# EAGLE design bldc (EAGLE 6.4)
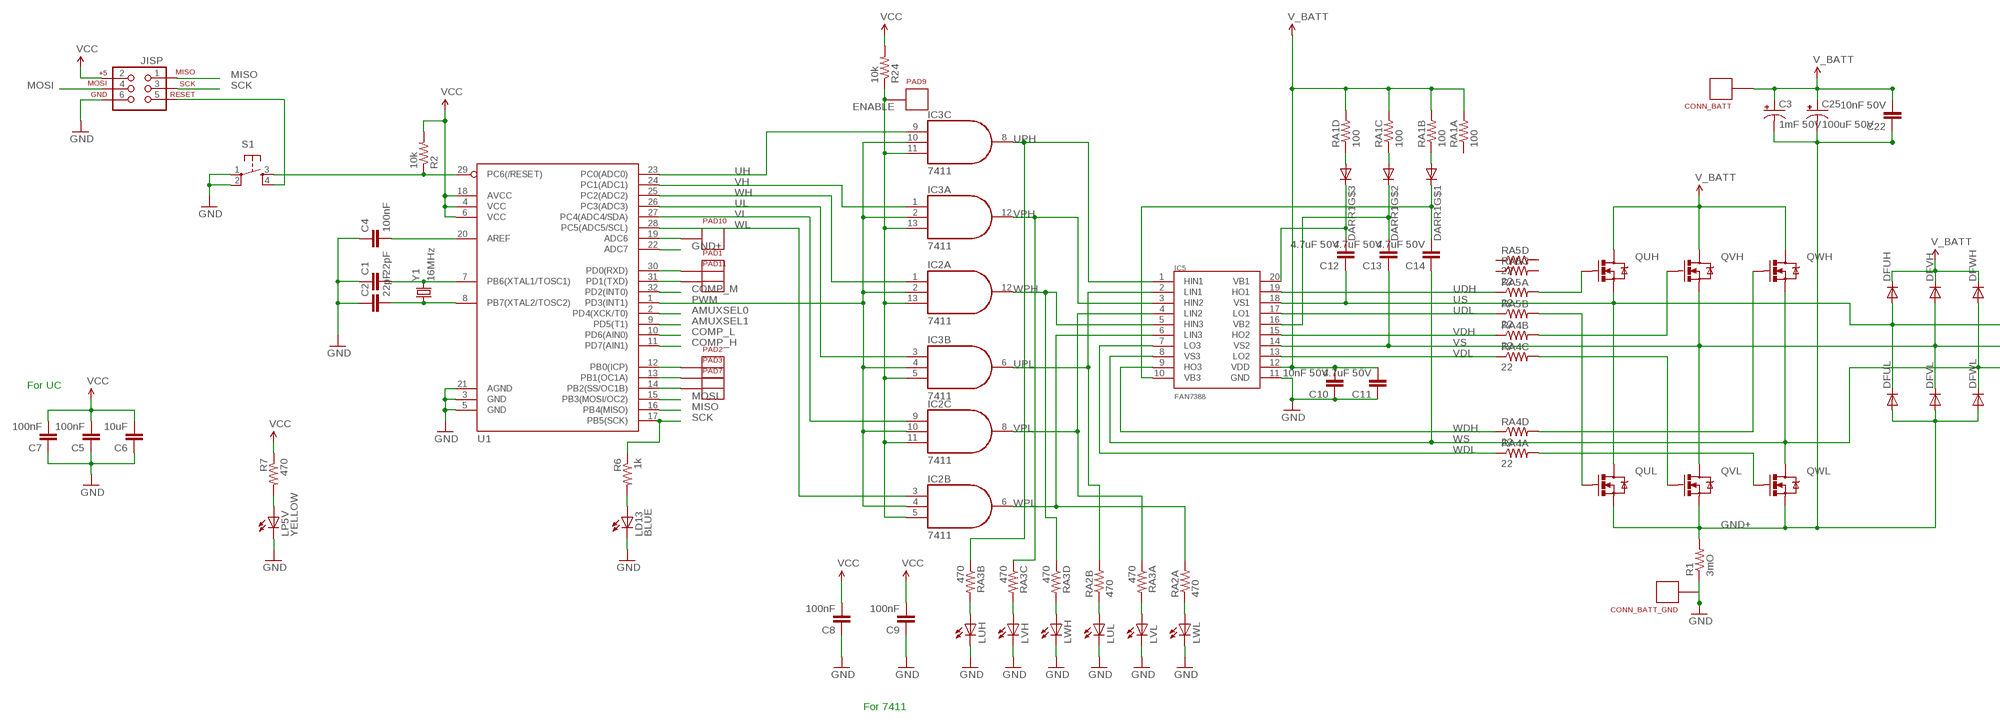
[diagram p0: schematic, sheet 1, part 1 of 2]
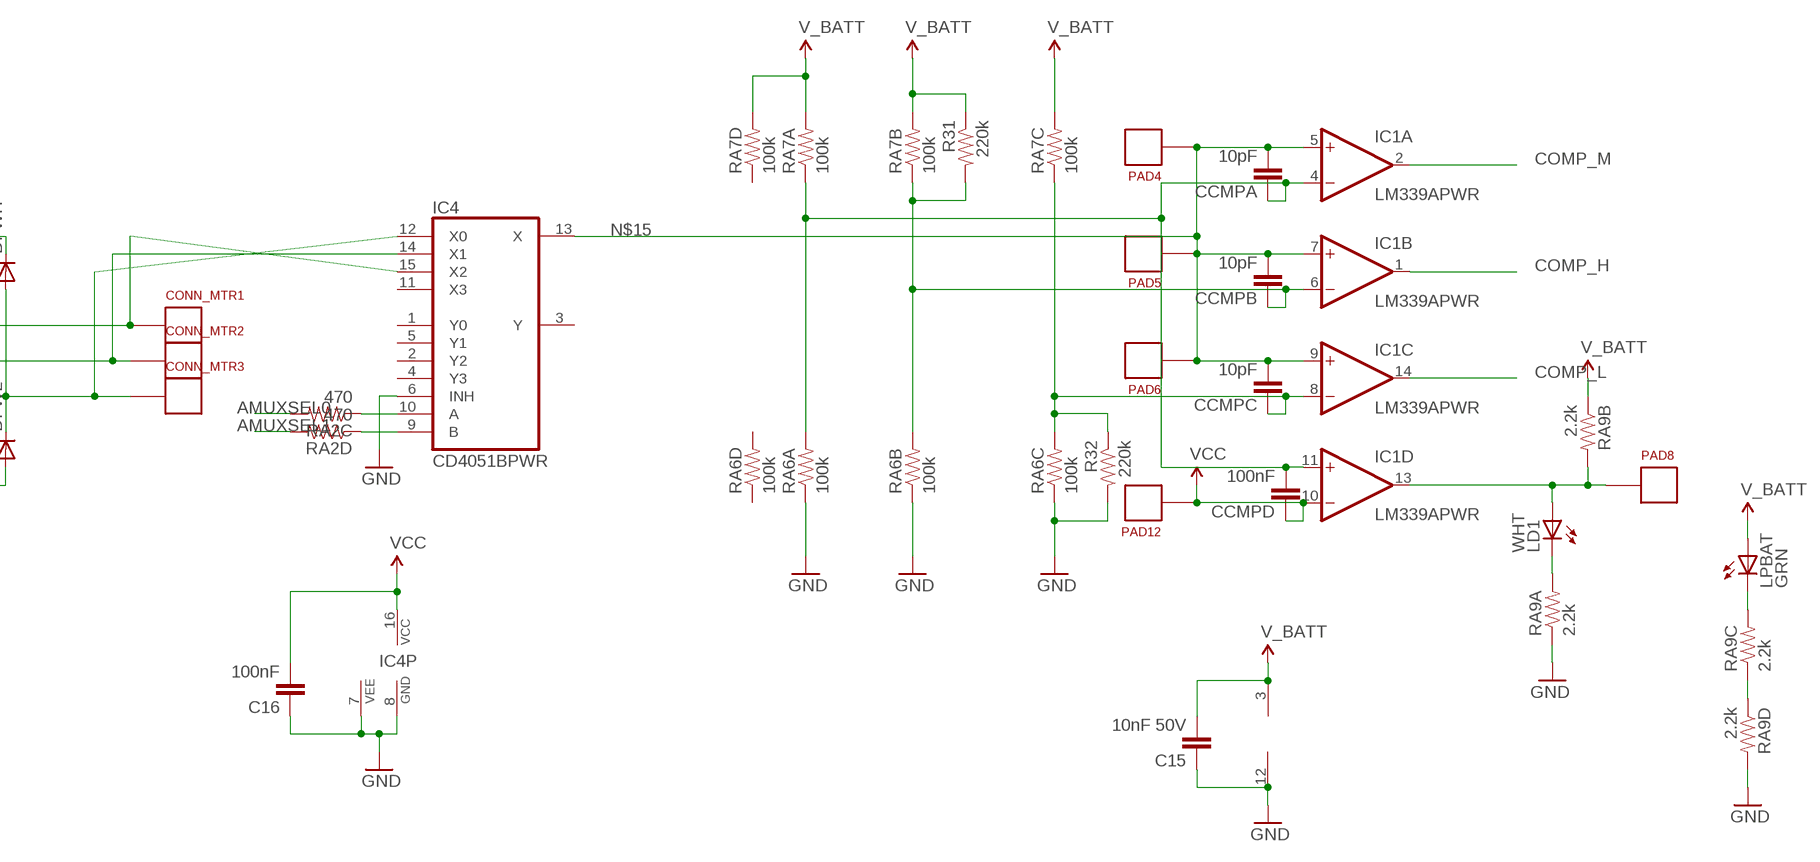
[diagram p1: schematic, sheet 1, part 2 of 2]

## Parts
C1  22pF  10NF-CER  [0402-CAP]
C2  22pF  10NF-CER  [0402-CAP]
C3  1mF 50V  CAP_POLPTH5  [CPOL-RADIAL-1000UF-50V]
C4  100nF  10NF-CER  [0402-CAP]
C5  100nF  10NF-CER  [0402-CAP]
C6  10uF  22UF-6.3V-20%(0805)  [0805]
C7  100nF  10NF-CER  [0402-CAP]
C8  100nF  10NF-CER  [0402-CAP]
C9  100nF  10NF-CER  [0402-CAP]
C10  10nF 50V  10NF-CER  [0402-CAP]
C11  4.7uF 50V  22UF-6.3V-20%(0805)  [0805]
C12  4.7uF 50V  22UF-6.3V-20%(0805)  [0805]
C13  4.7uF 50V  22UF-6.3V-20%(0805)  [0805]
C14  4.7uF 50V  22UF-6.3V-20%(0805)  [0805]
C15  10nF 50V  10NF-CER  [0402-CAP]
C16  100nF  10NF-CER  [0402-CAP]
C22  10nF 50V  10NF-CER  [0402-CAP]
C25  100uF 50V  CAP_POLPTH1  [CPOL-RADIAL-100UF-25V]
CCMPA  10pF  10NF-CER  [0402-CAP]
CCMPB  10pF  10NF-CER  [0402-CAP]
CCMPC  10pF  10NF-CER  [0402-CAP]
CCMPD  100nF  10NF-CER  [0402-CAP]
CONN_BATT  CONNECTOR18AWG  [HOLE_18AWG]
CONN_BATT_GND  CONNECTOR18AWG  [HOLE_18AWG]
CONN_MTR1  CONNECTOR18AWG  [HOLE_18AWG]
CONN_MTR2  CONNECTOR18AWG  [HOLE_18AWG]
CONN_MTR3  CONNECTOR18AWG  [HOLE_18AWG]
DARR1  SD103ATW-7-F  [SOT363]
DFUH  DIODESOD123W  [SOD123W(NXP)]
DFUL  DIODESOD123W  [SOD123W(NXP)]
DFVH  DIODESOD123W  [SOD123W(NXP)]
DFVL  DIODESOD123W  [SOD123W(NXP)]
DFWH  DIODESOD123W  [SOD123W(NXP)]
DFWL  DIODESOD123W  [SOD123W(NXP)]
IC1  LM339APWR  LM339  [TSSOP14]
IC2  7411  [TSSOP14]
IC3  7411  [TSSOP14]
IC4  CD4051BPWR  4052  [TSSOP16]
IC5  FAN7388  [SO20W]
JISP  AVR_SPI_PRG_6PTH  [2X3]
LD1  WHT  LED0603  [0603_LED]
LD13  BLUE  LED0603  [0603_LED]
LP5V  YELLOW  LED0603  [0603_LED]
LPBAT  GRN  LED0603  [0603_LED]
LUH  LED0603  [0603_LED]
LUL  LED0603  [0603_LED]
LVH  LED0603  [0603_LED]
LVL  LED0603  [0603_LED]
LWH  LED0603  [0603_LED]
LWL  LED0603  [0603_LED]
PAD1  PD0  CONNECTOR  [TESTPAD]
PAD2  PB0  CONNECTOR  [TESTPAD]
PAD3  PB1  CONNECTOR  [TESTPAD]
PAD4  CMPA  CONNECTOR  [TESTPAD]
PAD5  CMPB  CONNECTOR  [TESTPAD]
PAD6  CMPC  CONNECTOR  [TESTPAD]
PAD7  PB2  CONNECTOR  [TESTPAD]
PAD8  PGD  CONNECTOR  [TESTPAD]
PAD9  ENBL  CONNECTOR  [TESTPAD]
PAD10  ADC6  CONNECTOR  [TESTPAD]
PAD11  PD1  CONNECTOR  [TESTPAD]
PAD12  VREF  CONNECTOR  [TESTPAD]
QUH  NXP_LFPAK_NFET  [POWERSO8]
QUL  NXP_LFPAK_NFET  [POWERSO8]
QVH  NXP_LFPAK_NFET  [POWERSO8]
QVL  NXP_LFPAK_NFET  [POWERSO8]
QWH  NXP_LFPAK_NFET  [POWERSO8]
QWL  NXP_LFPAK_NFET  [POWERSO8]
R1  3mO  RESISTOROAR5  [OAR5]
R2  10k  RESISTOR0603-RES  [0603-RES]
R6  1k  RESISTOR0603-RES  [0603-RES]
R7  470  RESISTOR0603-RES  [0603-RES]
R24  10k  RESISTOR0603-RES  [0603-RES]
R31  220k  RESISTOR0603-RES  [0603-RES]
R32  220k  RESISTOR0603-RES  [0603-RES]
RA1  100  RESISTOR_ARRAY0603_X4  [0603-ARV]
RA2  470  RESISTOR_ARRAY0603_X4  [0603-ARV]
RA3  470  RESISTOR_ARRAY0603_X4  [0603-ARV]
RA4  22  RESISTOR_ARRAY0603_X4  [0603-ARV]
RA5  22  RESISTOR_ARRAY0603_X4  [0603-ARV]
RA6  100k  RESISTOR_ARRAY0603_X4  [0603-ARV]
RA7  100k  RESISTOR_ARRAY0603_X4  [0603-ARV]
RA9  2.2k  RESISTOR_ARRAY0603_X4  [0603-ARV]
S1  TAC_SWITCHPTH  [TACTILE-PTH]
U1  ATMEGA328_SMT  [TQFP32-08]
Y1  16MHz  CRYSTALSMD  [HC49UP]

## Nets
AMUXSEL0: RA2.6 U1.2(PD4(XCK/T0))
AMUXSEL1: RA2.5 U1.9(PD5(T1))
COMP_H: IC1.1(B:OUT) U1.11(PD7(AIN1))
COMP_L: IC1.14(C:OUT) U1.10(PD6(AIN0))
COMP_M: IC1.2(A:OUT) U1.32(PD2(INT0))
CTL0: PAD2.P U1.12(PB0(ICP))
CTL1: PAD3.P U1.13(PB1(OC1A))
CTL2: PAD7.P U1.14(PB2(SS/OC1B))
CTL3: PAD1.P U1.30(PD0(RXD))
ENABLE: IC2.5(B:I2) IC2.11(C:I2) IC2.13(A:I2) IC3.5(B:I2) IC3.11(C:I2) IC3.13(A:I2) PAD9.P R24.1
GND: C1.1 C2.1 C4.1 C5.1 C6.1 C7.1 C8.1 C9.1 C10.1 C11.1 C15.1 C16.1 CONN_BATT_GND.P$1(P) IC1.12(P:GND) IC4.6(INH) IC4.7(VEE) IC4.8(GND) IC5.11(GND) JISP.6 LD13.C LP5V.C LUH.C LUL.C LVH.C LVL.C LWH.C LWL.C R1.P$1 R32.2 RA6.1 RA6.2 RA6.3 RA9.1 RA9.5 S1.1 S1.2 U1.3(GND) U1.5(GND) U1.21(AGND)
GND+: C3.2(-) C22.1 C25.2(-) DFUL.A DFVL.A DFWL.A QUL.P1(S) QUL.P2(S) QUL.P3(S) QVL.P1(S) QVL.P2(S) QVL.P3(S) QWL.P1(S) QWL.P2(S) QWL.P3(S) R1.P$2 U1.22(ADC7)
GUH: QUH.P4(G) RA5.8
GUL: QUL.P4(G) RA5.7
GVH: QVH.P4(G) RA4.7
GVL: QVL.P4(G) RA4.6
GWH: QWH.P4(G) RA4.5
GWL: QWL.P4(G) RA4.8
MISO: JISP.1 U1.16(PB4(MISO))
MOSI: JISP.4 U1.15(PB3(MOSI/OC2))
N$1: C1.2 U1.7(PB6(XTAL1/TOSC1)) Y1.2
N$2: C2.2 U1.8(PB7(XTAL2/TOSC2)) Y1.1
N$3: CCMPA.1 CCMPD.2 IC1.4(A:-IN) IC1.11(D:+IN) RA6.8 RA7.1
N$4: IC1.13(D:OUT) LD1.A PAD8.P RA9.7
N$5: C4.2 U1.20(AREF)
N$6: LD13.A R6.2
N$7: RA9.3 RA9.4
N$8: LUH.A RA3.7
N$9: LWL.A RA2.1
N$10: LP5V.A R7.2
N$11: CCMPB.1 IC1.6(B:-IN) R31.2 RA6.7 RA7.2
N$12: IC4.10(A) RA2.3
N$13: LD1.C RA9.8
N$14: IC4.9(B) RA2.4
N$15: CCMPA.2 CCMPB.2 CCMPC.2 IC1.5(A:+IN) IC1.7(B:+IN) IC1.9(C:+IN) IC4.13(X) PAD4.P PAD5.P PAD6.P
N$16: LPBAT.C RA9.6
N$17: CCMPC.1 IC1.8(C:-IN) R32.1 RA6.6 RA7.3
N$20: C14.2 DARR1.1(C) IC5.10(VB3)
N$21: DARR1.4(A) RA1.4
N$22: DARR1.5(A) RA1.3
N$23: DARR1.6(A) RA1.2
N$24: JISP.5 S1.4
N$25: LVH.A RA3.6
N$26: LWH.A RA3.5
N$27: LUL.A RA2.2
N$28: PAD10.P U1.19(ADC6)
N$29: PAD11.P U1.31(PD1(TXD))
N$30: C13.2 DARR1.2(C) IC5.16(VB2)
N$31: C12.2 DARR1.3(C) IC5.20(VB1)
N$36: LVL.A RA3.8
PWM: IC2.2(A:I1) IC2.4(B:I1) IC2.10(C:I1) IC3.2(A:I1) IC3.4(B:I1) IC3.10(C:I1) U1.1(PD3(INT1))
RESET: R2.1 S1.3 U1.29(PC6(/RESET))
SCK: JISP.3 R6.1 U1.17(PB5(SCK))
UDH: IC5.19(HO1) RA5.1
UDL: IC5.17(LO1) RA5.2
UH: IC3.9(C:I0) U1.23(PC0(ADC0))
UL: IC3.3(B:I0) U1.26(PC3(ADC3))
UPH: IC3.8(C:O) IC5.1(HIN1) RA3.2
UPL: IC3.6(B:O) IC5.2(LIN1) RA2.7
US: C12.1 CONN_MTR1.P$1(P) DFUH.A DFUL.C IC4.15(X2) IC5.18(VS1) QUH.P1(S) QUH.P2(S) QUH.P3(S) QUL.P$1(D) QUL.P$5(D) QUL.P$6(D) QUL.P$7(D) QUL.P$8(D) QUL.P$9(D) QUL.P$10(D) QUL.P$11(D) QUL.P$12(D) QUL.P$13(D) QUL.P$14(D) QUL.P$15(D) QUL.P$16(D) QUL.P$17(D) QUL.P$19(D) QUL.P$20(D) QUL.P$21(D)
V_BATT: C3.1(+) C10.2 C11.2 C15.2 C22.2 C25.1(+) CONN_BATT.P$1(P) DFUH.C DFVH.C DFWH.C IC1.3(P:V+) IC5.12(VDD) LPBAT.A QUH.P$1(D) QUH.P$5(D) QUH.P$6(D) QUH.P$7(D) QUH.P$8(D) QUH.P$9(D) QUH.P$10(D) QUH.P$11(D) QUH.P$12(D) QUH.P$13(D) QUH.P$14(D) QUH.P$15(D) QUH.P$16(D) QUH.P$17(D) QUH.P$19(D) QUH.P$20(D) QUH.P$21(D) QVH.P$1(D) QVH.P$5(D) QVH.P$6(D) QVH.P$7(D) QVH.P$8(D) QVH.P$9(D) QVH.P$10(D) QVH.P$11(D) QVH.P$12(D) QVH.P$13(D) QVH.P$14(D) QVH.P$15(D) QVH.P$16(D) QVH.P$17(D) QVH.P$19(D) QVH.P$20(D) QVH.P$21(D) QWH.P$1(D) QWH.P$5(D) QWH.P$6(D) QWH.P$7(D) QWH.P$8(D) QWH.P$9(D) QWH.P$10(D) QWH.P$11(D) QWH.P$12(D) QWH.P$13(D) QWH.P$14(D) QWH.P$15(D) QWH.P$16(D) QWH.P$17(D) QWH.P$19(D) QWH.P$20(D) QWH.P$21(D) R31.1 RA1.5 RA1.6 RA1.7 RA1.8 RA7.5 RA7.6 RA7.7 RA7.8 RA9.2
VCC: C5.2 C6.2 C7.2 C8.2 C9.2 C16.2 CCMPD.1 IC1.10(D:-IN) IC4.16(VCC) JISP.2 PAD12.P R2.2 R7.1 R24.2 U1.4(VCC) U1.6(VCC) U1.18(AVCC)
VDH: IC5.15(HO2) RA4.2
VDL: IC5.13(LO2) RA4.3
VH: IC3.1(A:I0) U1.24(PC1(ADC1))
VL: IC2.9(C:I0) U1.27(PC4(ADC4/SDA))
VPH: IC3.12(A:O) IC5.3(HIN2) RA3.3
VPL: IC2.8(C:O) IC5.4(LIN2) RA3.1
VS: C13.1 CONN_MTR2.P$1(P) DFVH.A DFVL.C IC4.14(X1) IC5.14(VS2) QVH.P1(S) QVH.P2(S) QVH.P3(S) QVL.P$1(D) QVL.P$5(D) QVL.P$6(D) QVL.P$7(D) QVL.P$8(D) QVL.P$9(D) QVL.P$10(D) QVL.P$11(D) QVL.P$12(D) QVL.P$13(D) QVL.P$14(D) QVL.P$15(D) QVL.P$16(D) QVL.P$17(D) QVL.P$19(D) QVL.P$20(D) QVL.P$21(D)
WDH: IC5.9(HO3) RA4.4
WDL: IC5.7(LO3) RA4.1
WH: IC2.1(A:I0) U1.25(PC2(ADC2))
WL: IC2.3(B:I0) U1.28(PC5(ADC5/SCL))
WPH: IC2.12(A:O) IC5.5(HIN3) RA3.4
WPL: IC2.6(B:O) IC5.6(LIN3) RA2.8
WS: C14.1 CONN_MTR3.P$1(P) DFWH.A DFWL.C IC4.12(X0) IC5.8(VS3) QWH.P1(S) QWH.P2(S) QWH.P3(S) QWL.P$1(D) QWL.P$5(D) QWL.P$6(D) QWL.P$7(D) QWL.P$8(D) QWL.P$9(D) QWL.P$10(D) QWL.P$11(D) QWL.P$12(D) QWL.P$13(D) QWL.P$14(D) QWL.P$15(D) QWL.P$16(D) QWL.P$17(D) QWL.P$19(D) QWL.P$20(D) QWL.P$21(D)
Unconnected: IC4.1(Y0) IC4.2(Y2) IC4.3(Y) IC4.4(Y3) IC4.5(Y1) IC4.11(X3) RA1.1 RA5.3 RA5.4 RA5.5 RA5.6 RA6.4 RA6.5 RA7.4

## Notes on the sheet
- For UC
- For 7411

## Power pins joined to a net without a drawn wire
GND: IC2.7(P:GND) IC3.7(P:GND)
VCC: IC2.14(P:VCC) IC3.14(P:VCC)

## Library data of the parts
C1 C2 C4 C5 C7-C10 C15 C16 C22 CCMPA CCMPB CCMPC CCMPD = SparkFun-Capacitors:10NF-CER: 10nF/.01uF/10000pF ceramic SMT CAP-00867- 50V 10% (0603); PROD_ID: CAP-00867; VALUE: 10nF
C3 C25 = kmod:CAP_POL: Capacitor Polarized These are standard SMD and PTH capacitors. Normally 10uF, 47uF, and 100uF in electrolytic and tantalum varieties. Always verify the external diameter of the through hole cap, it varies with capacity, voltage, and manufacturer. The EIA devices should be standard.
C6 C11 = SparkFun-Capacitors:22UF-6.3V-20%(0805): Ceramic CAP-08402; PROD_ID: CAP-08402; VALUE: 22uF
C12-C14 = SparkFun-Capacitors:22UF-6.3V-20%(0805): Ceramic CAP-08402; PROD_ID: CAP-08402; VALUE: 22uF; VOLTAGE: 40
CONN_BATT CONN_BATT_GND CONN_MTR1-CONN_MTR3 PAD1-PAD12 = kmod:CONNECTOR
DARR1 = kmod:SD103ATW-7-F: Diode array: 3x
DFUH DFUL DFVH DFVL DFWH DFWL = kmod:DIODE
IC1 = kmod:LM339: Low Power Low Offset Voltage Quad Comparators with open collector; LM139/LM239/LM339/LM2901/LM3302
IC2 IC3 = kmod:74*11: Triple 3-input AND gate
IC4 = kmod:4052: Dual 4-channel ANALOG MULTIPLEXER
IC5 = kmod:FAN7388
JISP = SparkFun-Connectors:AVR_SPI_PRG_6: AVR ISP 6 Pin This is the reduced ISP connector for AVR programming. Common on Arduino. This footprint will take up less PCB space and can be used with a 10-pin to 6-pin adapter such as SKU: BOB-08508
LD1 LD13 LP5V LPBAT LUH LUL LVH LVL LWH LWL = kmod:LED
QUH QUL QVH QVL QWH QWL = kmod:NXP_LFPAK_NFET
R1 = kmod:RESISTOR: Resistor Basic schematic elements and footprints for 0603, 1206, and PTH resistors.
R2 R6 R7 R24 R31 R32 = SparkFun-Resistors:RESISTOR: Resistor Basic schematic elements and footprints for 0603, 1206, and PTH resistors.
RA1-RA7 RA9 = kmod:RESISTOR_ARRAY
S1 = SparkFun-Electromechanical:TAC_SWITCH: Momentary Switch Button commonly used for reset or general input. Spark Fun Electronics SKU : COM-00097 SMT- SWCH-08247
U1 = SparkFun-DigitalIC:ATMEGA328_SMT: 32-Pin Atmega328 part Commonly used on Arduino compatible boards Available in QFP and QFN packages TQFP is IC-09069 QFN is non-stock; PROD_ID: IC-09069; VALUE: ATMEGA328P
Y1 = SparkFun-FreqCtrl:CRYSTAL: Various standard crystals. Proven footprints. Spark Fun Electronics SKU : COM-00534

## Board
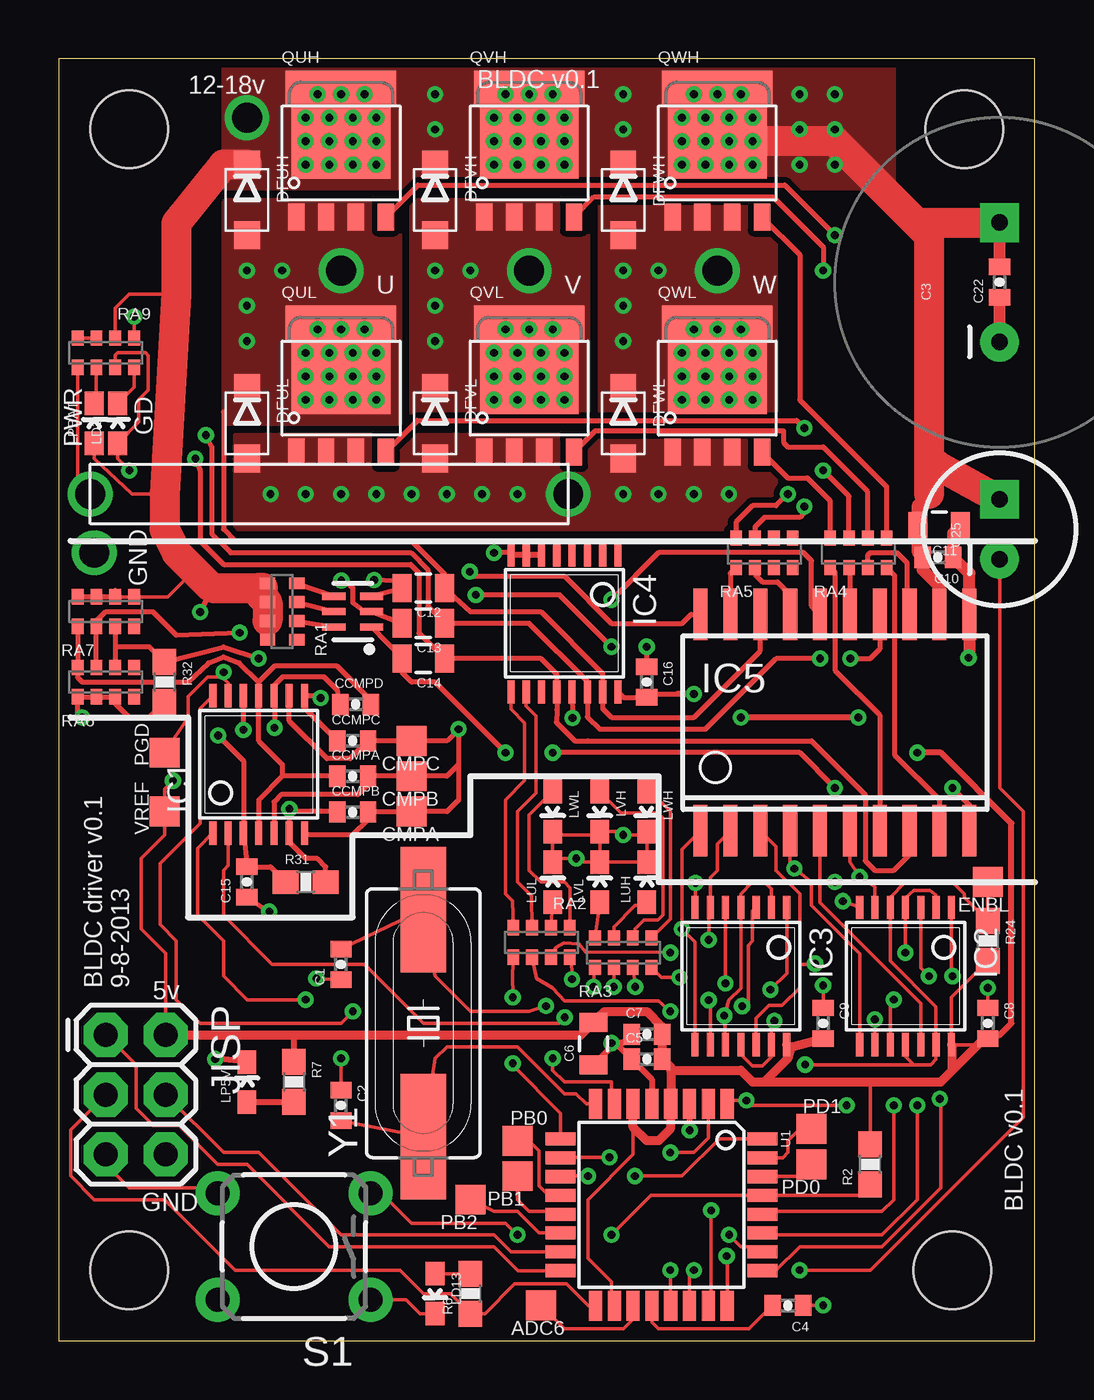
[diagram p2: board, top side]
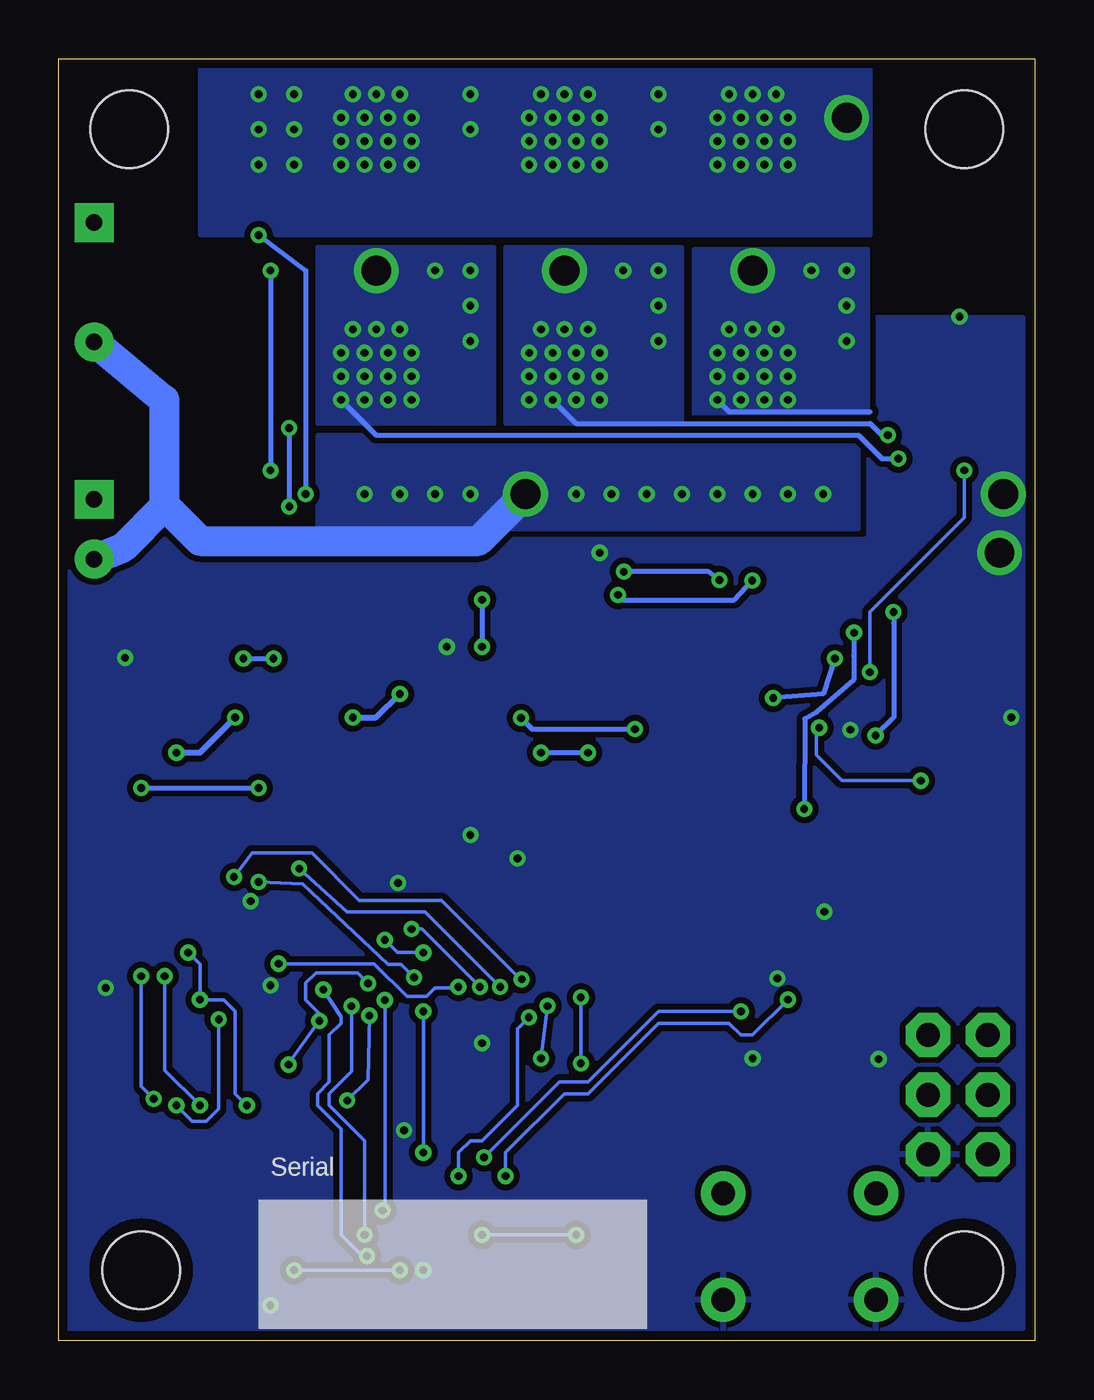
[diagram p3: board, bottom side, seen from below]

Size 41.5 x 54.5 mm. Coordinates in mm from the lower left corner, seen from the top.
Outline: 0,0 41.5,0 41.5,54.5 0,54.5 0,0
Copper layers (1*16): Top 0.0356mm / dielectric 1.5011mm / Bottom 0.0356mm
Design rules "OSHPark_mine": minimum track width 6mil, minimum drill 13mil, track to track 6mil, track to pad 6mil, pad to pad 6mil, via to via 6mil, smd to smd 6mil, copper to edge 15mil, drill to drill 6mil, minimum pad ring 7mil, minimum via ring 7mil, stop-mask expansion 4mil, vias tented up to drill 0mil, thermal gap 10mil

### Footprints (pad centres in the part's own frame; a part is rotated, then mirrored left to right if it is on the bottom)
0402-CAP = smd 0.7 x 0.9: 1 -0.65,0; 2 0.65,0
CPOL-RADIAL-1000UF-50V = drill 0.7 pad 1.651 square: 1 2.54,0 | drill 0.7 pad 1.651: 2 -2.54,0
0805 = smd 0.8 x 1.2: 1 -0.9,0; 2 0.9,0
CPOL-RADIAL-100UF-25V = drill 0.7 pad 1.651 square: 1 1.27,0 | drill 0.7 pad 1.651: 2 -1.27,0
HOLE_18AWG = drill 1.27: P$1 0,0
SOT363 = smd 0.3 x 0.99: 1 -0.65,-0.8; 2 0,-0.8; 3 0.65,-0.8; 4 0.65,0.81; 5 0,0.81; 6 -0.65,0.81
SOD123W(NXP) = smd 1.2 x 1.1: A 1.5,0; C -1.5,0
TSSOP14 = smd 0.305 x 0.991: 1 -1.95,-2.918; 2 -1.3,-2.918; 3 -0.65,-2.918; 4 0,-2.918; 5 0.65,-2.918; 6 1.3,-2.918; 7 1.95,-2.918; 8 1.95,2.918; 9 1.3,2.918; 10 0.65,2.918; 11 0,2.918; 12 -0.65,2.918; 13 -1.3,2.918; 14 -1.95,2.918
TSSOP16 = smd 0.305 x 0.991: 1 -2.275,-2.918; 2 -1.625,-2.918; 3 -0.975,-2.918; 4 -0.325,-2.918; 5 0.325,-2.918; 6 0.975,-2.918; 7 1.625,-2.918; 8 2.275,-2.918; 9 2.275,2.918; 10 1.625,2.918; 11 0.975,2.918; 12 0.325,2.918; 13 -0.325,2.918; 14 -0.975,2.918; 15 -1.625,2.918; 16 -2.275,2.918
SO20W = smd 0.6 x 2.2: 1 -5.715,-4.6; 2 -4.445,-4.6; 3 -3.175,-4.6; 4 -1.905,-4.6; 5 -0.635,-4.6; 6 0.635,-4.6; 7 1.905,-4.6; 8 3.175,-4.6; 9 4.445,-4.6; 10 5.715,-4.6; 11 5.715,4.6; 12 4.445,4.6; 13 3.175,4.6; 14 1.905,4.6; 15 0.635,4.6; 16 -0.635,4.6; 17 -1.905,4.6; 18 -3.175,4.6; 19 -4.445,4.6; 20 -5.715,4.6
2X3 = drill 1.016 pad 1.88 octagon: 1 0,0; 2 0,2.54; 3 2.54,0; 4 2.54,2.54; 5 5.08,0; 6 5.08,2.54
0603_LED = smd 0.8 x 1.003: A 0,-0.852; C 0,0.852
TESTPAD = smd 1.27 x 1.27: P 0,0
POWERSO8 = smd 0.7 x 1.15: P1 -1.905,-2.725; P2 -0.635,-2.725; P3 0.635,-2.725; P4 1.905,-2.725 | smd 4.2 x 3.1: P$1 0,0.45 | smd 4.7 x 1.5: P$5 0,2.75 | drill 0.33: P$6 -1.5,1.5; P$7 -1.5,0.5; P$8 -1.5,-0.5; P$9 -0.5,-0.5; P$10 -0.5,0.5; P$11 -0.5,1.5; P$12 0.5,1.5; P$13 0.5,0.5; P$14 0.5,-0.5; P$15 1.5,-0.5; P$16 1.5,0.5; P$17 1.5,1.5; P$19 1,2.5; P$20 0,2.5; P$21 -1,2.5
OAR5 = drill 1.27: P$1 -10.16,0; P$2 10.16,0
0603-RES = smd 1.1 x 1: 1 -0.85,0; 2 0.85,0
0603-ARV = smd 0.5 x 0.65: 1 -1.2,-0.625; 2 -0.4,-0.625; 3 0.4,-0.625; 4 1.2,-0.625; 5 1.2,0.625; 6 0.4,0.625; 7 -0.4,0.625; 8 -1.2,0.625
TACTILE-PTH = drill 1.016 pad 1.88: 1 -3.251,2.261; 2 3.251,2.261; 3 -3.251,-2.261; 4 3.251,-2.261
TQFP32-08 = smd 1.27 x 0.559: 1 -4.293,2.8; 2 -4.293,2; 3 -4.293,1.2; 4 -4.293,0.4; 5 -4.293,-0.4; 6 -4.293,-1.2; 7 -4.293,-2; 8 -4.293,-2.8; 17 4.293,-2.8; 18 4.293,-2; 19 4.293,-1.2; 20 4.293,-0.4; 21 4.293,0.4; 22 4.293,1.2; 23 4.293,2; 24 4.293,2.8 | smd 0.559 x 1.27: 9 -2.8,-4.293; 10 -2,-4.293; 11 -1.2,-4.293; 12 -0.4,-4.293; 13 0.4,-4.293; 14 1.2,-4.293; 15 2,-4.293; 16 2.8,-4.293; 25 2.8,4.293; 26 2,4.293; 27 1.2,4.293; 28 0.4,4.293; 29 -0.4,4.293; 30 -1.2,4.293; 31 -2,4.293; 32 -2.8,4.293
STAND-OFF = hole 3.302: 0,0
HC49UP = smd 5.334 x 1.93: 1 -4.826,0; 2 4.826,0

### Placement (x,y rotation side)
C1  12,16 90 top
C2  12,10 270 top
C3  40,45 90 top
C4  31,1.5 180 top
C5  25,11.97 0 top
C6  22.73,12.63 90 top
C7  25,13.03 0 top
C8  39.5,13.5 270 top
C9  32.5,13.5 270 top
C10  37.38,33.3 180 top
C11  37.43,34.63 180 top
C12  15.5,32 180 top
C13  15.5,30.5 180 top
C14  15.5,29 180 top
C15  8,19.5 90 top
C16  25,28 270 top
C22  40,45 90 top
C25  40,34.5 90 top
CCMPA  12.5,24 0 top
CCMPB  12.5,22.47 0 top
CCMPC  12.5,25.5 0 top
CCMPD  12.63,27.05 0 top
CONN_BATT  8,52 180 top
CONN_BATT_GND  1.5,33.5 180 top
CONN_MTR1  12,45.5 180 top
CONN_MTR2  20,45.5 180 top
CONN_MTR3  28,45.5 180 top
DARR1  12.5,31 90 top
DFUH  8,48.5 270 top
DFUL  8,39 270 top
DFVH  16,48.5 270 top
DFVL  16,39 270 top
DFWH  24,48.5 270 top
DFWL  24,39 270 top
IC1  8.5,24.5 0 top
IC2  36,15.5 180 top
IC3  29,15.5 180 top
IC4  21.5,30.5 180 top
IC5  33,26.28 0 top
JISP  2,13 270 top
LD1  2.5,39 0 top
LD13  16,2 180 top
LP5V  8,11 0 top
LPBAT  1.5,39 0 top
LUH  25,19.5 0 top
LUL  21,19.5 0 top
LVH  23,22.5 180 top
LVL  23,19.5 0 top
LWH  25,22.5 180 top
LWL  21,22.5 180 top
PAD1  32,7.5 0 top
PAD2  19.5,8.5 180 top
PAD3  19.5,7 0 top
PAD4  15,22.5 0 top
PAD5  15,24 0 top
PAD6  15,25.5 0 top
PAD7  17.5,6 0 top
PAD8  4.5,25 270 top
PAD9  39.5,19.5 0 top
PAD10  20.5,1.5 0 top
PAD11  32,9 180 top
PAD12  4.5,22.5 270 top
QUH  12,50.5 0 top
QUL  12,40.5 0 top
QVH  20,50.5 0 top
QVL  20,40.5 0 top
QWH  28,50.5 0 top
QWL  28,40.5 0 top
R1  11.5,36 0 top
R2  34.5,7.5 90 top
R6  17.5,2 90 top
R7  10,11 270 top
R24  39.5,17 270 top
R31  10.5,19.5 0 top
R32  4.5,28 270 top
RA1  9.5,31 90 top
RA2  20.53,16.93 180 top
RA3  24,16.5 0 top
RA4  34,33.5 0 top
RA5  30,33.5 0 top
RA6  2,28 0 top
RA7  2,31 0 top
RA9  2,42 180 top
S1  10,4 180 top
U1  25.62,5.78 270 top
U$1  [STAND-OFF]  3,51.5 0 top
U$2  [STAND-OFF]  38.5,51.5 0 top
U$3  [STAND-OFF]  38,3 0 top
U$4  [STAND-OFF]  3,3 0 top
Y1  15.5,13.5 90 top

### Tracks (layer width: path | path; a pad name or v marks a point on that pad's centre or on a via)
AMUXSEL0  (via drill 0.33)
  Top 0.152: RA2.6 20.32,15.41 21,15 21.5,14.45 25.5,14.45 v26,14 | v26,8 27,8 27.62,8.62 U1.2
  Bottom 0.152: v26,14 v26,8
AMUXSEL1  (via drill 0.33)
  Top 0.152: RA2.5 19.3,15.6 v19.3,14.6 | v19.3,11.79 19.3,11.7 21.33,9.67 U1.9
  Bottom 0.152: v19.3,14.6 v19.3,11.79
COMP_H  (via drill 0.33)
  Top 0.152: U1.11 21.35,7 v22.5,7 | v10.5,14.5 8,14.5 7,15.5 7,17 5.9,18.1 5.9,20.93 IC1.1
  Bottom 0.152: v22.5,7 22.5,8 20,10.5 19,10.5 16,13.5 13,13.5 12.5,13 12,13 v10.5,14.5
COMP_L  (via drill 0.33)
  Top 0.152: U1.10 21.34,7.8 v23.42,7.8 | v12.5,14 12,13.5 6,13.5 5,14.5 5,17 4.3,17.7 4.3,20.3 6,22 6,26.87 IC1.14
  Bottom 0.152: v23.42,7.8 20.22,11 19,11 16,14 v12.5,14
COMP_M  (via drill 0.33)
  Top 0.152: v21.51,13.74 21.27,13.5 15.5,13.5 13,16 9.07,16 7,18.07 7,20 7.2,20.2 IC1.2 | v24.5,7 26.5,7 28.08,8.58 U1.32
  Bottom 0.152: v21.51,13.74 22,13.26 22,10 23.5,8.5 24,8.5 24.5,8 v24.5,7
CTL0
  Top 0.152: U1.12 20.82,6.18 20.42,6.58 20.42,8.08 20,8.5 PAD2.P
CTL1
  Top 0.152: PAD3.P 19.5,6 20,5.5 21.21,5.5 U1.13
CTL2
  Top 0.152: U1.14 20.42,4.58 19.5,5.5 18.5,5.5 PAD7.P
CTL3
  Top 0.152: PAD1.P 31.48,6.98 U1.30
ENABLE  (via drill 0.33)
  Top 0.152: PAD9.P R24.1 38.5,18.85 38.5,19 38,19.5 36,19.5 35.35,18.85 IC2.5 35.35,16.15 37.3,14.2 IC2.13 37.3,11.95 37.08,11.73 36.35,11.73 | 36.35,11.73 36,12.08 IC2.11 | 36.35,11.73 v31.73,11.73 | v30.42,13.6 30.3,13.48 IC3.13 30.3,12.06 29.92,11.68 29.49,11.68 29,12.17 IC3.11 | IC3.5 v28.35,15.19
  Bottom 0.152: v31.73,11.73 31.77,11.73 v30.42,13.6 30.42,13.92 31,14.5 31,15.2 30.56,15.65 28.8,15.65 v28.35,15.19
GND  (via drill 0.33)
  Top 0.152: LWH.C 24.85,21.5 v24,21.5 23.85,21.65 LVH.C | LVL.C 22.15,20.35 v22,20.5 21.15,20.5 LUL.C 21,21.5 | LWL.C 21,21.5 | 21,21.5 23,21.5 23,20.5 23.15,20.35 LUH.C 25,21.5 | C8.1 v39.5,15 | C9.1 v32.5,15.1 | IC2.7 v33.34,18.69 | C1.1 v10.95,15.4 | C2.1 v12,12 | S1.1 14.76,1.74 15.35,1.15 LD13.C | C4.1 v32.5,1.5 | U1.21 26,1.51 v26,3 | IC3.7 v27.08,19.46 | 6.64,11.99 v6.64,11.97 | RA9.1 3.2,43.36 v3.2,43.54 | RA9.5 0.8,36.54 R1.P$1
  Top 0.203: C15.1 v8.95,18.24 | v1,26.5 0.8,26.7 RA6.1 RA6.2 RA6.3 2.4,27.1 3,26.5 3.85,26.5 R32.2 | IC1.12 v7.85,25.97 | C16.1 v25,29.5 | IC4.8 19.14,33.5 v18.5,33.5
  Top 0.254: IC4.8 IC4.7 IC4.6 | C6.1 23.5,12.5 v23.5,12.65 | C7.1 23.98,12.65 v23.5,12.65 | v23.5,12.65 23.67,12.65 C5.1 25.22,11.11 U1.5 | U1.3 v26.82,8.94 | LP5V.C 6.64,11.99
  Top 0.508: C11.1 38.03,34.33 C10.1 38.72,32.62 IC5.11 38.72,29.06 v38.68,29.03
  pour Bottom (isolate 0.254, rank 3): 41.5,38.5 41.5,0.5 0.5,0.5 0.5,38.5
  pour Bottom (isolate 0.254, rank 3, no thermals): 0.5,43.5 41,43.5 41,31.5 0.5,31.5
GND+  (via drill 0.33)
  Top 0.152: C25.2 40,23.5 41,22.5 41,9.5 34.5,3 v31.5,3 | v27,3 26.82,2.82 U1.22
  Top 0.508: C3.2 C22.1
  Bottom 0.152: v31.5,3 v27,3
  Bottom 1.27: C25.2 38.77,33.73 37,35.5 | 37,35.5 37,40 37.04,40 C3.2 | 37,35.5 35.5,34 23.66,34 R1.P$2
  other vias: 19.5,36 18,36 16.5,36 15,36 13.5,36 12,36 10.5,36 9,36 24,36 25.5,36 27,36 28.5,36
  pour Top (isolate 0.254, rank 2, no thermals): 30.5,38.5 30.5,34.5 7.5,34.5 7.5,38.5
  pour Bottom (isolate 0.254, rank 2, no thermals): 30.5,38.5 30.5,34.5 7.5,34.5 7.5,38.5
GUH  (via drill 0.33)
  Top 0.203: QUH.P4 15.27,49.14 30.86,49.14 v33,47 | v31,36 30.5,35.5 29.5,35.5 28.8,34.8 RA5.8
  Bottom 0.203: v33,47 31,45.5 v31,36
GUL  (via drill 0.33)
  Top 0.203: QUL.P4 15.25,39.12 31.38,39.12 v31.7,38.8 | v31.7,35.46 31.7,35.2 31.5,35 30,35 29.6,34.6 RA5.7
  Bottom 0.203: v31.7,38.8 v31.7,35.47 v31.7,35.46
GVH  (via drill 0.33)
  Top 0.203: QVH.P4 22.76,48.63 30.37,48.63 32.5,46.5 v32.5,45.5 | RA4.7 33.6,35.9 v32.5,37
  Bottom 0.203: v32.5,45.5 v32.5,37
GVL
  Top 0.203: QVL.P4 22.82,38.69 30.81,38.69 30.81,38.19 31,38 32.5,38 34.4,36.1 RA4.6
GWH
  Top 0.203: QWH.P4 31.5,46.18 31.5,40 35.2,36.3 RA4.5
GWL
  Top 0.203: QWL.P4 31,36.68 31.82,36.68 32.8,35.7 RA4.8
MISO
  Top 0.152: JISP.1 3.28,11.72 3.28,9.89 4.02,9.15 5.11,9.15 6.76,7.5 8,7.5 11.5,4 18.5,4 19.52,2.98 U1.16
MOSI
  Top 0.152: JISP.4 7,8 8.5,8 12,4.5 18.5,4.5 19.22,3.78 U1.15
N$1  (via drill 0.33)
  Top 0.152: C1.2 Y1.2 16,15.5 17.5,14 20,14 v20.72,14.23 | v21,12 21,11.5 21.5,11 23.5,11 23.5,10.19 U1.7
  Bottom 0.152: v20.72,14.23 v21,12
N$2
  Top 0.152: C2.2 Y1.1 16,12 16.5,12.5 19.5,12.5 21.5,10.5 22,10.5 22.43,10.07 U1.8
N$3
  Top 0.203: RA7.1 RA6.8 0.8,28.2 1,28 5.5,28 6.37,28.82 7,29.08 7.68,28.82 8.5,28 | CCMPA.1 9.5,24 | 9.5,24 8.5,23 IC1.4 | 9.5,24 9.5,24.5 8.5,25.5 IC1.11 8.5,28 | CCMPD.2 13.28,27.22 11.82,28.68 9.18,28.68 8.5,28
N$4  (via drill 0.33)
  Top 0.152: IC1.13 7.2,27.95 6.93,28.22 | 6.93,28.22 6.33,28.22 5.5,27.39 5.5,26.5 PAD8.P | 6.93,28.22 6.88,28.27 v7.01,28.42 | v3,37 2.5,37.5 LD1.A 3.4,39.05 3.4,40.01 3.81,40.41 3.81,41.88 3.69,42 2.5,42 2.4,41.9 RA9.7
  Bottom 0.152: v7.01,28.42 7.01,30.99 3,35 v3,37
N$5
  Top 0.152: C4.2 29.35,0.5 25.5,0.5 25.22,0.78 U1.20
N$6
  Top 0.152: LD13.A R6.2
N$7
  Top 0.152: RA9.4 RA9.3
N$8
  Top 0.152: LUH.A 24.85,18.5 24.5,18.5 23.6,17.6 RA3.7
N$9
  Top 0.152: LWL.A 20,22.35 20,20 20.5,19.5 21.5,19.5 21.74,19.26 RA2.1
N$10
  Top 0.254: LP5V.A R7.2
N$11  (via drill 0.33)
  Top 0.203: RA6.7 RA7.2 1.6,30.6 2,31 4,31 5,30 v7.69,30.1 | CCMPB.1 11.82,22.5 10,22.5 | 10,22.5 9.8,22.3 IC1.6 9.8,21.2 10.5,20.5 11,20.5 11.35,20.15 R31.2 | v9.8,22.6 9.91,22.5 10,22.5
  Bottom 0.203: v7.69,30.1 7.7,29.12 7.7,28.1 9.27,26.72 9.78,26.44 v9.8,22.6
N$12
  Top 0.152: IC4.10 19.88,26.99 20.3,26.57 20.3,23.3 19.5,22.5 19.5,19.5 20.1,18.9 RA2.3
N$13
  Top 0.152: RA9.8 3.2,40.55 LD1.C
N$14
  Top 0.152: IC4.9 19.23,26.85 19.81,26.26 19.81,23.81 19,23 19,19 19.3,18.7 RA2.4
N$15  (via drill 0.33)
  Top 0.203: IC4.13 v21.84,26.47 | 17,24.5 v17,26 16.5,25.5 PAD6.P CCMPC.2 12.39,24.74 11.4,24.74 9.8,26.35 IC1.9 | 17,24.5 16.5,24 PAD5.P CCMPA.2 13.15,23.65 12.72,23.22 9.46,23.22 9.15,22.91 IC1.5 | 17,24.5 17,23 16.5,22.5 PAD4.P 14.97,22.48 CCMPB.2 13.15,22.15 12.5,21.5 10.53,21.5 IC1.7
  Bottom 0.203: v21.84,26.47 21.37,26 v17,26
N$16
  Top 0.152: RA9.6 1.6,39.95 LPBAT.C
N$17  (via drill 0.33)
  Top 0.203: RA7.3 2.4,29.5 | 2.4,29.5 RA6.6 | CCMPC.1 10.45,26.9 IC1.8 10.92,27.42 v11.13,27.32 | 2.4,29.5 3.85,29.5 R32.1 7,29.5 v8.5,29
  Bottom 0.203: v8.5,29 9,27.5 v11.13,27.32
N$20  (via drill 0.33)
  Top 0.203: DARR1.1 C14.2 14.6,28.4 15,28 16,28 v19,25 | IC5.10 38.72,22.79 v38,23.5 | v33,23.5 31.5,25 v21,25
  Bottom 0.203: v38,23.5 v33,23.5 | v21,25 v19,25
N$21
  Top 0.203: RA1.4 DARR1.4
N$22
  Top 0.203: RA1.3 DARR1.5
N$23
  Top 0.203: RA1.2 DARR1.6
N$24
  Top 0.152: JISP.5 2,7.5 3,6.5 7.01,6.5 S1.4
N$25
  Top 0.152: RA3.6 24.5,17.23 24.5,17.5 24.88,17.88 25.48,17.88 25.68,18.11 25.68,22.23 25.48,22.43 23.9,22.43 23,23.33 LVH.A
N$26
  Top 0.152: RA3.5 26,17.93 26,22.5 25.15,23.35 LWH.A
N$27
  Top 0.152: LUL.A RA2.2
N$28
  Top 0.152: U1.19 24.42,0.92 24,0.5 21.5,0.5 PAD10.P
N$29
  Top 0.152: PAD11.P 31.5,9 31,8.5 31,8 30.78,7.78 U1.31
N$30  (via drill 0.33)
  Top 0.203: C13.2 DARR1.2 13,31 12.5,31.37 12.5,32 12.26,32.24 v12.01,32.32 | IC5.16 32,31.24 32,33.16 31.66,33.5 25.5,33.5 v23.5,31.5 | v23.5,29.5 21.29,31.71 v17.73,31.71
  Bottom 0.203: v23.5,31.5 v23.5,29.5 | v17.73,31.71 17.52,31.5 12.78,31.5 v12.01,32.32
N$31  (via drill 0.33)
  Top 0.203: DARR1.3 C12.2 14.31,32.29 v13.41,32.34 | v17.48,32.69 17.67,32.5 21.5,32.5 23.5,30.5 26.5,30.5 26.88,30.88 IC5.20
  Bottom 0.203: v13.41,32.34 13.87,32.69 v17.48,32.69
N$36
  Top 0.152: LVL.A RA3.8
PWM  (via drill 0.33)
  Top 0.152: IC2.2 37.3,18.96 37.03,19.15 36.35,19.15 36,18.83 IC2.4 v36,16.5 | v35.5,14.5 35.35,14.35 IC2.10 | U1.1 28.56,10.21 v29.23,10.21 29.45,10 v33.5,10 | IC3.2 30.3,19.2 30,19.5 29.5,19.5 29,19 IC3.4 29,14.97 28.5,14.5 v28.3,13.82 IC3.10
  Bottom 0.152: v36,16.5 35.5,16 v35.5,14.5 34.5,14.5 34,14 34,10.5 v33.5,10 | v29.23,10.21 28.35,11.1 v28.3,13.82
RESET  (via drill 0.33)
  Top 0.152: v23.5,4.5 25.18,6.18 U1.29 34.03,6.18 R2.1 | v19.5,4.5 19,5 15,5 13.75,6.25 S1.3
  Bottom 0.152: v19.5,4.5 v23.5,4.5
SCK
  Top 0.152: R6.1 16.65,2 15.5,2 14.5,3 7.5,3 4.5,6 1.5,6 0.5,7 0.5,8.96 JISP.3 | R6.1 17.84,1.49 | U1.17 22.51,1.49 21.59,2.41 19.38,2.41 18.12,1.15 R6.1
UDH
  Top 0.203: RA5.1 28.55,32.63 IC5.19
UDL
  Top 0.203: RA5.2 29.6,32.58 29.92,32.26 30.56,32.26 31.09,31.72 IC5.17
UH  (via drill 0.33)
  Top 0.152: U1.23 27.74,1.6 v27.74,5.54 | v27.64,14.48 27.7,14.41 IC3.9
  Bottom 0.152: v27.74,5.54 27.64,5.74 v27.64,14.48
UL  (via drill 0.33)
  Top 0.152: IC3.3 29.5,18.27 29.5,17 29.31,16.81 29.31,14.3 29.18,14.17 v29.06,14.22 | v28.5,4.5 29,4 29.69,4 U1.26
  Bottom 0.152: v29.06,14.22 29.06,11.44 30,10.5 30,10 28.5,8.5 v28.5,4.5
UPH  (via drill 0.33)
  Top 0.152: IC5.1 26.5,20.89 v26.5,17.5 27.05,16.95 IC3.8 | RA3.2 v23.6,15.04
  Bottom 0.152: v23.6,15.04 26.06,17.5 v26.5,17.5
UPL  (via drill 0.33)
  Top 0.152: IC5.2 28,21.12 28,20 27.7,19.7 IC3.6 27.64,18.35 v27.64,17.04 | RA2.7 21.13,16.71 21.49,16.92 22.12,16.87 22.4,16.54 v26,16.5
  Bottom 0.152: v26,16.5 27.09,16.5 v27.64,17.04
US  (via drill 0.33)
  Top 0.203: 7,39.5 7,34.5 7.5,34 15,34 16.4,32.6 C12.1 17.5,31 20.5,31 23.12,28.38 IC4.15 23.12,26.88 23.5,26.5 27,26.5 29.82,29.32 IC5.18
  Bottom 0.203: QUL.P$15 13,39.5 7,39.5
  other vias: 9.5,45.5 8,45.5 8,44 8,42.5
  pour Top (isolate 0.254, no thermals): 14.5,48.5 14.5,39 7,39 7,48.5
  pour Bottom (isolate 0.254, no thermals): 14.5,46.4 14.5,38.9 7.1,38.9 7.1,46.4
V_BATT  (via drill 0.33)
  Top 0.152: 8.68,32 RA1.5 | RA1.7 RA1.8 | 1.5,38.5 LPBAT.A 1.5,37.5 3.13,36 4.5,36 | RA7.6 RA7.5 4.62,31.62 5.75,32.75 | RA9.2 2.4,43.9 3,44.5 5,44.5
  Top 0.203: RA7.8 RA7.7 RA7.6 2.4,31.9 | R31.1 9,20.15 C15.2 IC1.3 7.85,24.65 v6.77,25.73 | 6.5,32 v6.01,30.98
  Top 0.508: IC5.12 37.45,32.05 36.73,32.77 C10.2 36.53,33.5 C11.2 36.53,35.53 37,36 37.27,37.27 | C22.2 C3.1
  Top 1.27: 36.46,47.54 33,51 QWH.P$16 | 36.46,47.54 C3.1 | 36.46,47.54 37,47 37,36 | DFUH.C 7,50 5,47.5 5,44.5 4.5,36 4.5,34.5 5,33.5 5.75,32.75 6.5,32 8.5,32 | 37.27,37.27 C25.1 | 8.5,32 8.68,32 | 8.5,32 8.5,31.77 RA1.6 RA1.7
  Bottom 0.203: v6.01,30.98 6,30.5 6,26.5 v6.77,25.73
  other vias: 16,53 16,51.5 24,53 24,51.5 31.5,53 31.5,51.5 33,51.5 33,53 31.5,50 33,50
  pour Top (isolate 0.254, rank 2, no thermals): 35.5,54.5 35.5,49 7,49 7,54.5
  pour Bottom (isolate 0.254, rank 2, no thermals): 35.5,54.5 35.5,47 7,47 7,54.5
VCC  (via drill 0.33)
  Top 0.152: R24.2 37.95,14.6 IC2.14 39.23,12.58 C8.2 | JISP.2 4.54,16.46 3.5,17.5 3.5,20.5 4.5,21.5 PAD12.P 4.5,23.46 v4.85,23.81 | U1.18 23.5,1.61 23.5,2.5 22.5,3.5 22.5,6 24.42,7.92 U1.6 | R2.2 34.5,11
  Top 0.203: IC4.16 24.01,27.35 C16.2 25.15,27.5 26.31,27.5 | CCMPD.1 11.85,27.65 11.28,28.22 9.53,28.22 9.15,27.85 IC1.10 9.17,27.4 v9.17,26.06
  Top 0.254: 39.5,13 40,13 40.5,13.5 40.5,22 37.5,25 v36.5,25 | v34,26.5 v29,26.5 | v27,27.5 26.31,27.5 | U1.6 24.5,10.15 | R7.1 10,13
  Top 0.381: 30,11 29.5,11 29,11.5 26.04,11.5 26.02,11.48 | 30,11 31,12 | 31,12 31,12.53 IC3.14 | 30,11 34.5,11 37.5,11 38,11.5 | 38,11.5 38,12.53 IC2.14 | 38,11.5 39.5,13 | 31,12 31.15,12.5 C9.2 | 26.02,11.48 26.02,11.63 C5.2 C7.2 25.65,13.35 25,14 23.2,14 C6.2 22.2,13 10,13 JISP.2 | 26.02,11.48 U1.4 26,10.05 26,9 25.5,8.5 25,8.5 24.42,9.08 U1.6
  Bottom 0.152: 9.3,25.93 9.3,24.89 8.21,23.81 v4.85,23.81
  Bottom 0.203: v9.17,26.06 9.3,25.93
  Bottom 0.254: v36.5,25 35.5,25 v34,26.5 | v29,26.5 28,26.5 v27,27.5
VDH
  Top 0.203: RA4.2 33.63,32.84 IC5.15
VDL
  Top 0.203: RA4.3 34.4,33.4 34.5,33.5 35.64,33.5 36.07,33.08 36.07,30.99 IC5.13
VH  (via drill 0.33)
  Top 0.152: U1.24 28.42,3.42 v28.4,3.6 | v30.25,14.93 30.95,15.63 IC3.1
  Bottom 0.152: v28.4,3.6 28.6,3.6 29.5,4.5 29.5,9 30.5,10 30.5,10.5 30,11 30,13 29.5,13.5 29.5,13.78 v30.25,14.93
VL  (via drill 0.33)
  Top 0.152: U1.27 29.99,4.5 35,4.5 36.5,6 v36.5,10 | v34.7,13.66 IC2.9
  Bottom 0.152: v36.5,10 35.82,9.32 35.23,9.32 34.7,9.86 v34.7,13.66
VPH  (via drill 0.33)
  Top 0.152: IC5.3 30.5,21 30.5,20 31.5,19 31.5,16 | 31.5,16 31.5,15 30.75,14.25 30.2,14.25 29.65,13.7 IC3.12 | RA3.3 24.41,15.87 v24.51,15.04 | v32.16,16.03 32.13,16 31.5,16
  Bottom 0.152: v24.51,15.04 24.55,15 25.5,15 25.87,14.63 26.7,14.63 28.09,16.03 v32.16,16.03
VPL  (via drill 0.33)
  Top 0.152: 31,22 31,21.77 IC5.4 31.09,20.41 v31.27,20.07 32,19.5 32,18.5 34.05,16.45 IC2.8 | RA3.1 22.78,15.86 v22.73,15.04
  Bottom 0.152: v22.73,15.04 25.93,18.24 29.24,18.24 v31.27,20.07
VS  (via drill 0.33)
  Top 0.203: IC5.14 34.91,29.41 34.5,29 v33.65,29 | v32.37,29 30.5,29 27.5,26 23,26 22.48,26.52 IC4.14 22.48,28.02 20,30.5 C13.1 15.7,31.2 15.7,32.77 14.97,33.5 7.3,33.5 6.5,34.3 6.5,38 v6.25,38.5
  Bottom 0.203: v33.65,29 v32.37,29 | QVL.P$14 19.5,39 7,39 6.5,38.5 v6.25,38.5
  other vias: 16,45.5 16,44 16,42.5 17.5,45.5
  pour Top (isolate 0.254, no thermals): 22.5,48.5 22.5,39 15,39 15,48.5
  pour Bottom (isolate 0.254, no thermals): 22.5,46.5 22.5,39 15,39 15,46.5
WDH
  Top 0.203: RA4.4 35.53,32.54 35.53,24.91 37.45,23 IC5.9
WDL
  Top 0.203: RA4.1 33,32.67 33,28.5 34.91,26.59 IC5.7
WH  (via drill 0.33)
  Top 0.152: U1.25 29.93,3 30.5,3 31.5,4 35,4 37.5,6.5 37.5,10 v37.47,10.29 | v38,15.5 37.95,15.55 IC2.1
  Bottom 0.152: v37.47,10.29 38,10.82 v38,15.5
WL  (via drill 0.33)
  Top 0.152: U1.28 30.03,5.5 35,5.5 35.5,6 v35.5,10 | v37,15.5 36.65,15.85 IC2.3
  Bottom 0.152: v35.5,10 37,11.5 v37,15.5
WPH  (via drill 0.33)
  Top 0.152: IC5.5 32.37,19.5 | 32.37,19.5 32.37,18.64 36.65,14.35 IC2.12 | RA3.4 25.63,15.44 v26.39,15.44 | v33,19.5 32.37,19.5
  Bottom 0.152: v26.39,15.44 26.95,16 27.5,16 31.13,19.42 v33,19.5
WPL  (via drill 0.33)
  Top 0.152: 33.5,22 33.5,21.81 IC5.6 33.63,20.36 v34.05,19.72 34.7,19.3 IC2.6 | RA2.8 21.82,15.76 v21.82,15.37
  Bottom 0.152: v21.82,15.37 21.82,15.32 25.22,18.72 28.73,18.72 30.73,20.73 33.27,20.73 v34.05,19.72
WS  (via drill 0.33)
  Top 0.203: v5.8,37.5 6,37 6,34 7,33 14.96,33 15.32,32.64 15.32,30.08 C14.1 20.5,29 21.18,28.32 IC4.12 21.18,26.82 21.16,26.29 21.95,25.51 22.5,25.5 32,25.5 34.29,23.21 34.29,20.4 34.69,20 35.5,20 36.17,20.68 IC5.8
  Bottom 0.203: QWL.P$15 28,38.5 7.5,38.5 6.5,37.5 v5.8,37.5
  other vias: 24,45.5 24,44 24,42.5 25.5,45.5
  pour Top (isolate 0.254, no thermals): 30.5,48.5 30.5,39 23,39 23,48.5
  pour Bottom (isolate 0.254, no thermals): 30.5,46.5 30.5,39 23,39 23,46.5

### Text on the board
tPlace: BLDC v0.1 | 12-18v | U | V | W | PWR | GD | GND | BLDC driver v0.1 / 9-8-2013 | 5v | GND | BLDC v0.1
bPlace: Serial